# EasyEDA schematic 1-Schematic_diy ups.json
TITLE: Sheet_1; REV: 1.0; Date: 2025-08-03; Sheet: 1/1; Drawn By: Mark; Company: Your Company
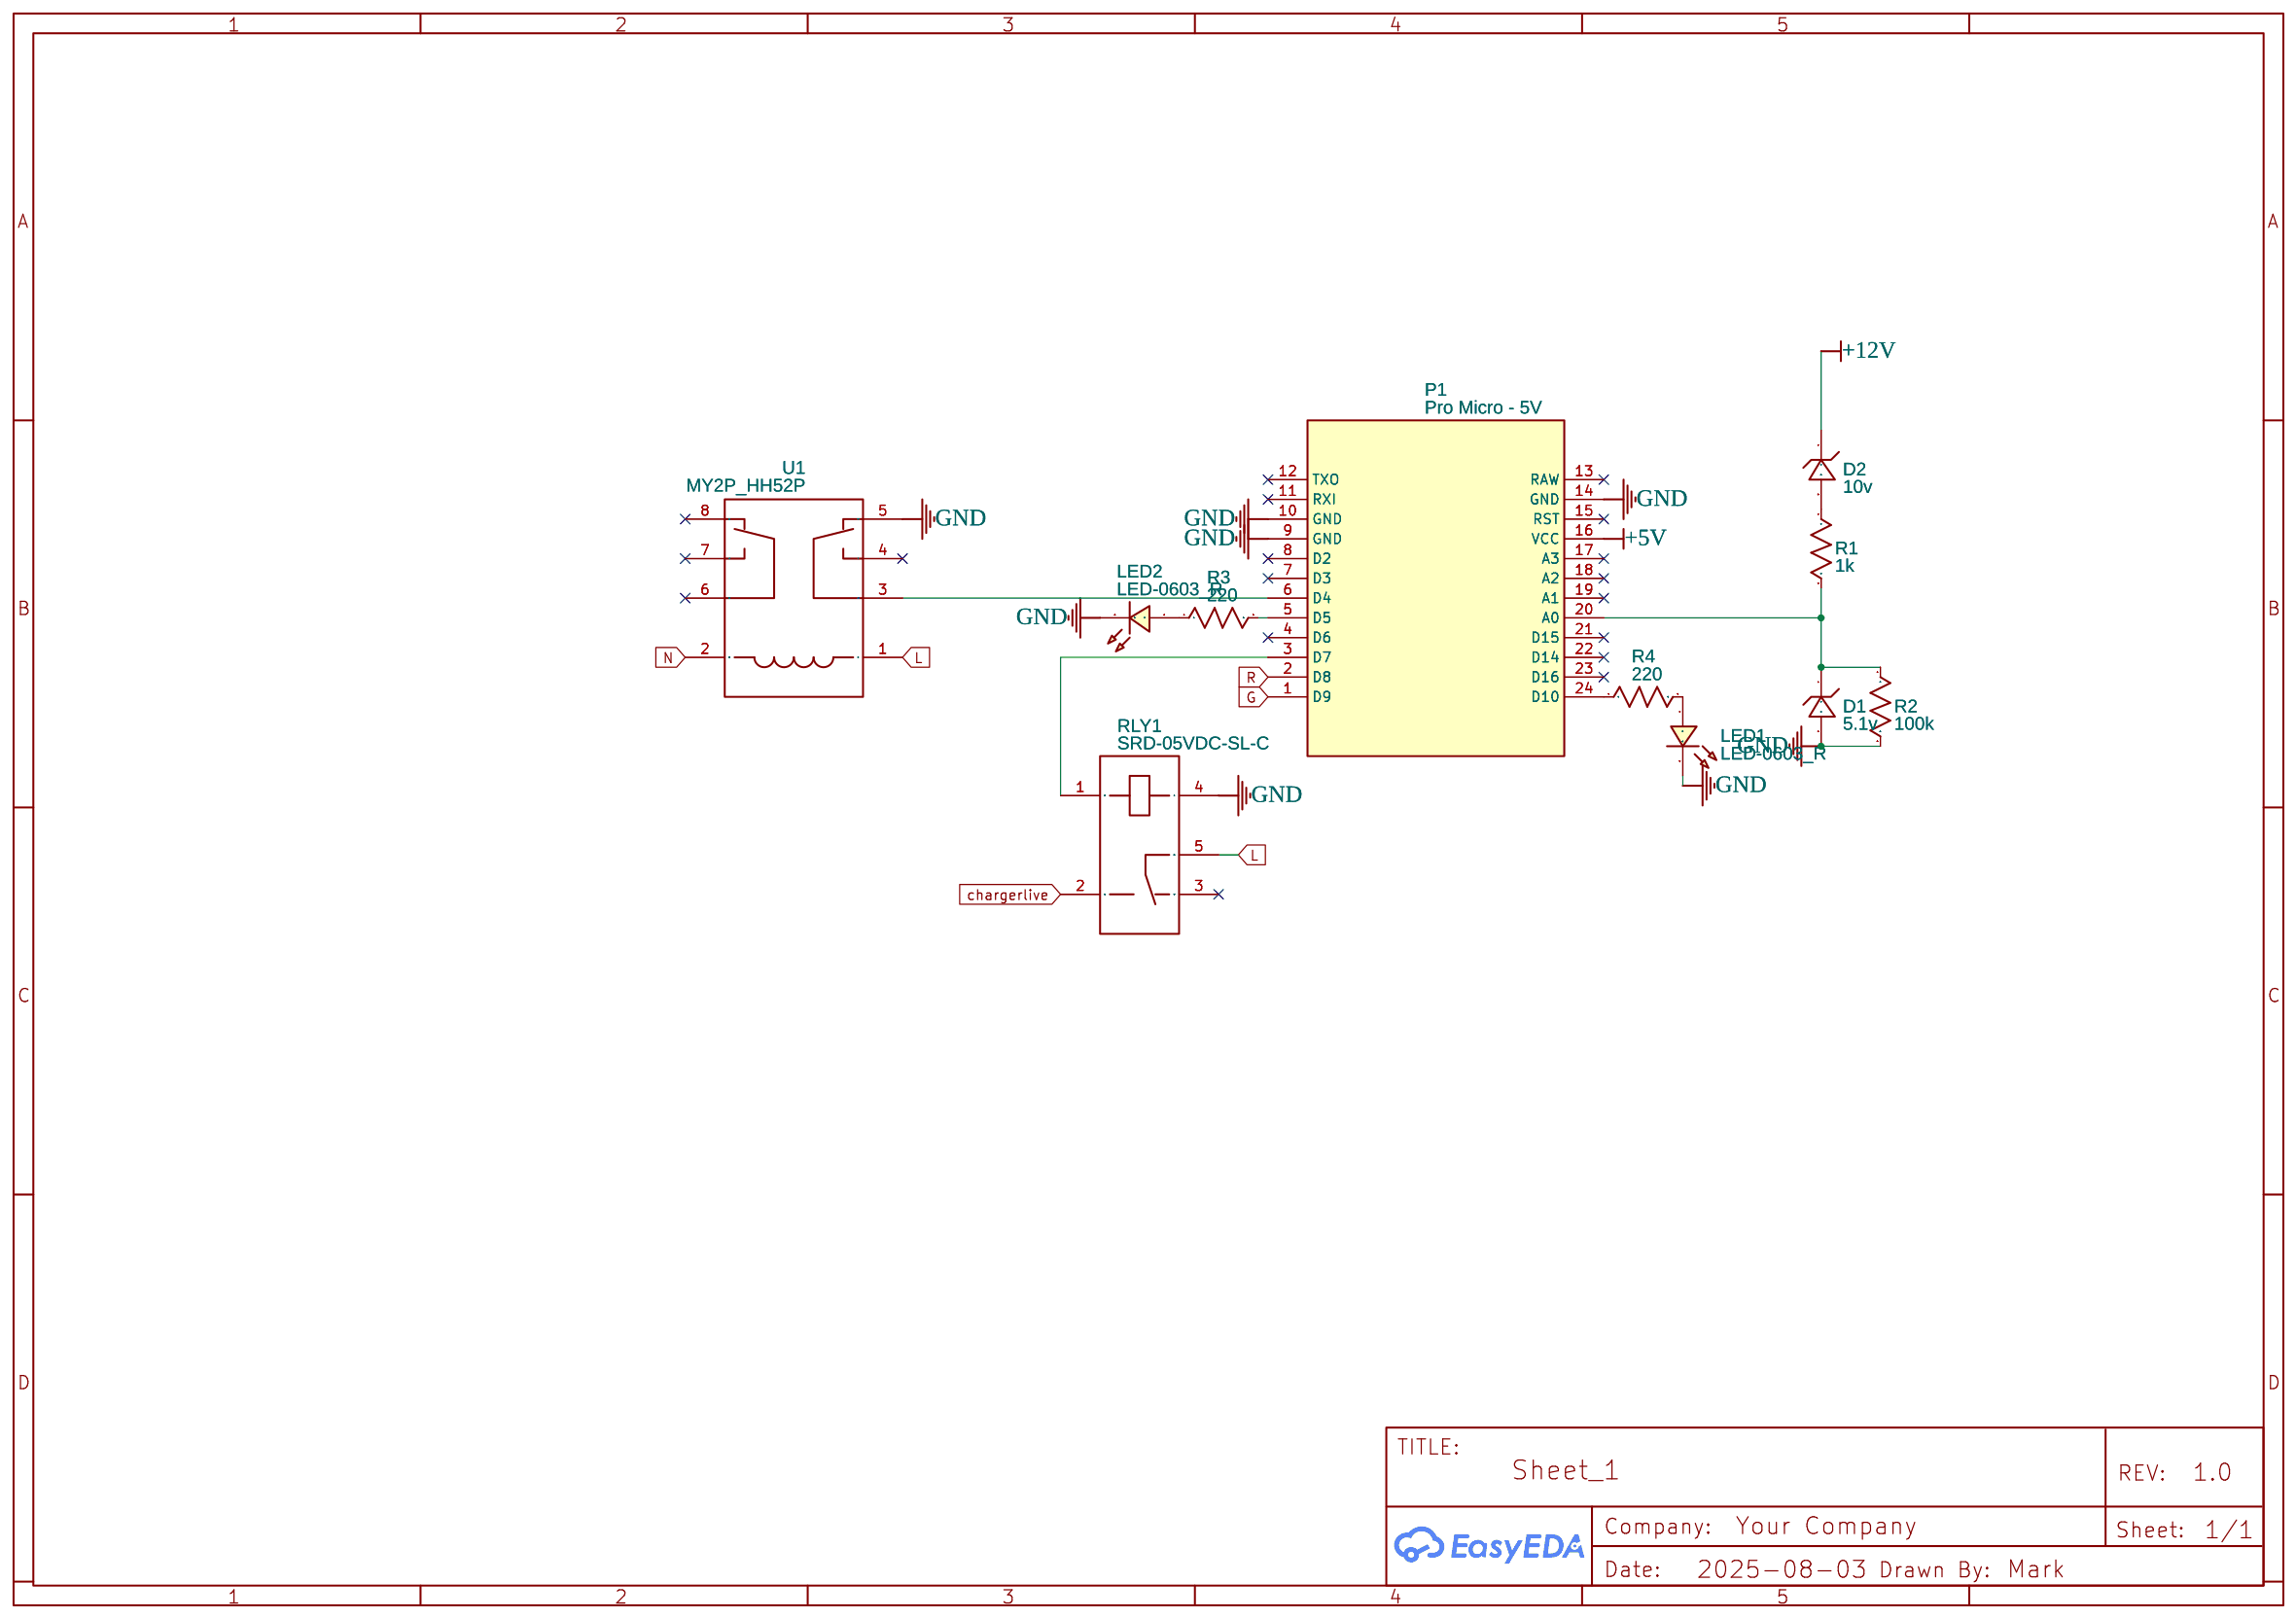
[diagram p0: schematic sheet]

## Parts
D1  5.1v  [DO-41_BD2.4-L4.7-P8.70-D0.9-RD]
D2  10v  [DO-41_BD2.4-L4.7-P8.70-D0.9-RD]
LED1  LED-0603_R  [LED0603_RED]
LED2  LED-0603_R  [LED0603_RED]
P1  Pro Micro - 5V  [PRO MICRO - 5V]
R1  1k  [R0603]
R2  100k  [R0603]
R3  220  [R0603]
R4  220  [R0603]
RLY1  SRD-05VDC-SL-C  [RELAY-TH_SRD-XXVDC-XL-C]
U1  MY2P_HH52P  [MY2P_HH52P]

## Library data of the parts
D1 D2 = 1N4740A_C194121: Contributor: LCSC; Supplier: LCSC; Supplier Part: C194121; Manufacturer: Multicomp; Manufacturer Part: 1N4740A; JLCPCB Part Class: Extended Part
LED1 LED2 = LED-0603_R: Manufacturer: EVERLIGHT(台湾亿光); Manufacturer Part: 19-217/R6C-AL1M2VY/3T; Supplier Part: C72044; Supplier: LCSC; Contributor: LCEDA_01
P1 = Pro Micro - 5V: sourceId: 1T5FDZYC8
R1-R4 = R_0603_US: Contributor: LCEDA_Lib
RLY1 = SRD-05VDC-SL-C: Supplier: LCSC; Manufacturer: 松乐; Supplier Part: C35449; JLCPCB Part Class: Extended Part
U1 = MY2P_HH52P: Manufacturer: Fuji Electric; link: https://datasheet.octopart.com/HH52P-DC24V-Fuji-Electric-datasheet-31827798.pdf; Contributor: Владислав Красильников

## Nets
+5V: P1.16(VCC)
+12V: D2.1
GND: D1.2 LED1.2 LED2.2 P1.9(GND) P1.10(GND) P1.14(GND) R2.2 RLY1.4 U1.5
chargerlive: RLY1.2
G: P1.1(D9)
L: RLY1.5 U1.1
N: U1.2
R: P1.2(D8)
Net-(D1-1): D1.1 P1.20(A0) R1.2 R2.1
Net-(D2-2): D2.2 R1.1
Net-(LED1-1): LED1.1 R4.2
Net-(LED2-1): LED2.1 R3.1
Net-(P1-3): P1.3(D7) RLY1.1
Net-(P1-5): P1.5(D5) R3.2
Net-(P1-6): P1.6(D4) U1.3
Net-(P1-24): P1.24(D10) R4.1

Not connected (* = marked no-connect by the designer): P1 4(D6)* 7(D3)* 8(D2)* 11(RXI)* 12(TXO)* 13(RAW)* 15(RST)* 17(A3)* 18(A2)* 19(A1)* 21(D15)* 22(D14)* 23(D16)*; RLY1 3*; U1 4* 6* 7* 8*
